# Altium schematic sheet launch_stand_interface.SchDoc
size A
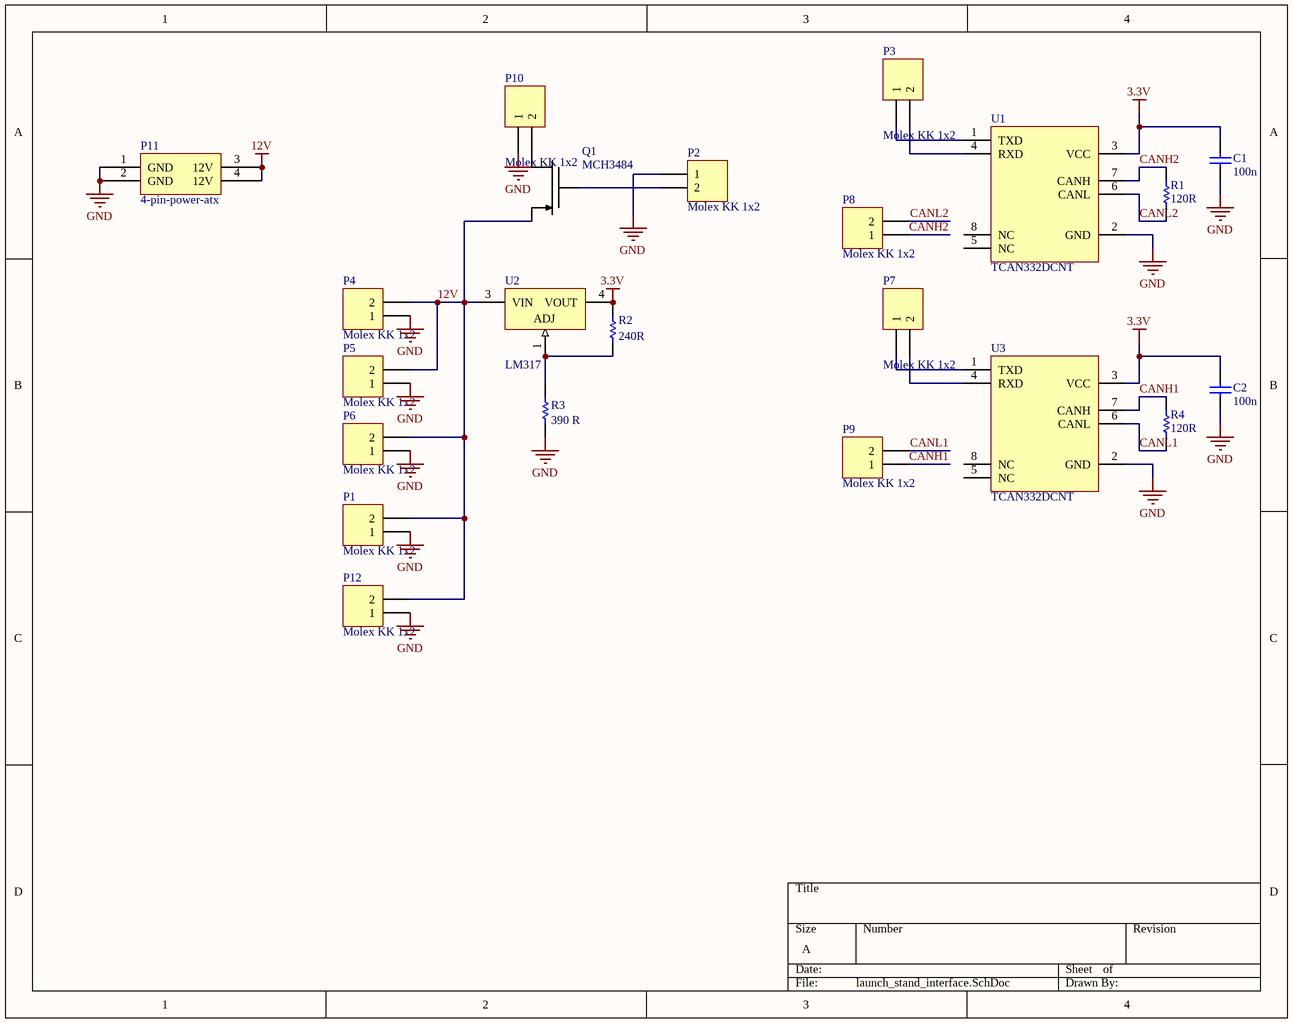
[diagram p0: launch_stand_interface.SchDoc]

## Parts
C1  100n  [C0805]
C2  100n  [C0805]
P1  Molex KK 1x2  [Molex KK 2x1]
P2  Molex KK 1x2  [Molex KK 2x1]
P3  Molex KK 1x2  [Molex KK 2x1]
P4  Molex KK 1x2  [Molex KK 2x1]
P5  Molex KK 1x2  [Molex KK 2x1]
P6  Molex KK 1x2  [Molex KK 2x1]
P7  Molex KK 1x2  [Molex KK 2x1]
P8  Molex KK 1x2  [Molex KK 2x1]
P9  Molex KK 1x2  [Molex KK 2x1]
P10  Molex KK 1x2  [Molex KK 2x1]
P11  4-pin-power-atx  [4-pin-atx]
P12  Molex KK 1x2  [Molex KK 2x1]
Q1  MCH3484  [SC-70FL/MCPH3]
R1  120R  [R0805]
R2  240R  [R0805]
R3  390 R  [R0805]
R4  120R  [R0805]
U1  TCAN332DCNT  [SOT-23-8]
U2  LM317  [D-PAK]
U3  TCAN332DCNT  [SOT-23-8]

## Nets
3.3V: C1.1 C2.1 R2.2 U1.3(VCC) U2.4(VOUT) U3.3(VCC)
12V: P1.2 P4.2 P5.2 P6.2 P11.3(12V) P11.4(12V) P12.2 Q1.2(Source) U2.3(VIN)
GND: C1.2 C2.2 P1.1 P2.1 P4.1 P5.1 P6.1 P10.1 P11.1(GND) P11.2(GND) P12.1 R3.1 U1.2(GND) U3.2(GND)
CANH1: P9.1 R4.2 U3.7(CANH)
CANH2: P8.1 R1.2 U1.7(CANH)
CANL1: P9.2 R4.1 U3.6(CANL)
CANL2: P8.2 R1.1 U1.6(CANL)
NetP2_2: P2.2 Q1.1(Gate)
NetP3_1: P3.1 U1.1(TXD)
NetP3_2: P3.2 U1.4(RXD)
NetP7_1: P7.1 U3.1(TXD)
NetP7_2: P7.2 U3.4(RXD)
NetP10_2: P10.2 Q1.3(Drain)
NetR2_1: R2.1 R3.2 U2.1(ADJ)

Not connected (* = marked no-connect by the designer): U1 5(NC) 8(NC); U3 5(NC) 8(NC)

## Library data of the parts
C1 C2 = C0805: 0805 Capacitor; Value: 100n
P1-P10 P12 = Molex KK 1x2: 1x2 Molex KK Connector
R1-R4 = R0805: RESISTOR 0805
  R1 R4: Value: 120R
  R2: Value: 240R
  R3: Value: 390 R
U1 U3 = TCAN332DCNT: IC TXRX CAN 3.3V SOT23-8
U2 = LM317: Linear Voltage Regulator